# Altium schematic sheet op-pcb-mcp23017-sch.SchDoc
size 149 x 149 mm; SheetNumber: 1; SheetTotal: 1
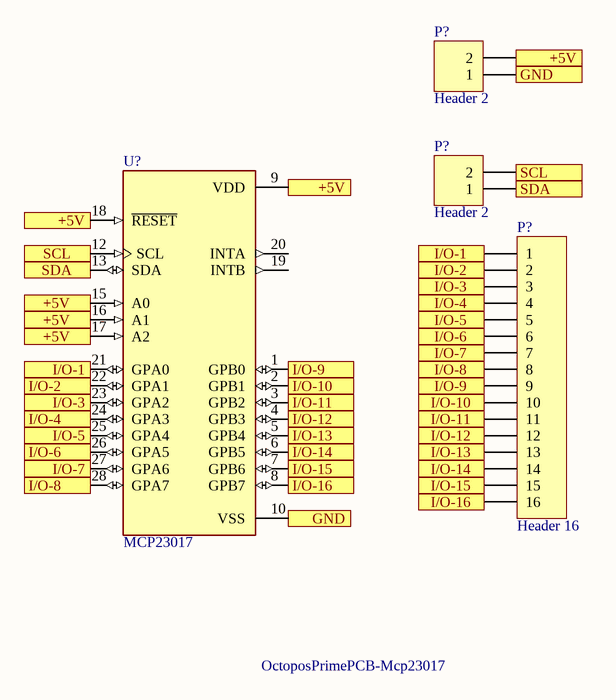
[diagram p0: op-pcb-mcp23017-sch.SchDoc]

## Parts
(Parts that share a designator on the sheet are numbered #1, #2 ... from top to bottom, then left to right.)
P?#1  Header 2  [HDR1X2]
P?#2  Header 2  [HDR1X2]
P?#3  Header 16  [HDR1X16]
U?  MCP23017  [MCP23017]

## Ports
+5V (in), GND (in), I/O-1 (in), I/O-2 (in), I/O-3 (in), I/O-4 (in), I/O-5 (in), I/O-6 (in), I/O-7 (in), I/O-8 (in), I/O-9 (in), I/O-10 (in), I/O-11 (in), I/O-12 (in), I/O-13 (in), I/O-14 (in), I/O-15 (in), I/O-16 (in), SCL (in), SDA (in)

## Nets
+5V: P?#1.2 U?.9(VDD) U?.15(A0) U?.16(A1) U?.17(A2) U?.18(~{RESET}) ; port +5V
GND: P?#1.1 U?.10(VSS) ; port GND
I/O-1: P?#3.1 U?.21(GPA0) ; port I/O-1
I/O-2: P?#3.2 U?.22(GPA1) ; port I/O-2
I/O-3: P?#3.3 U?.23(GPA2) ; port I/O-3
I/O-4: P?#3.4 U?.24(GPA3) ; port I/O-4
I/O-5: P?#3.5 U?.25(GPA4) ; port I/O-5
I/O-6: P?#3.6 U?.26(GPA5) ; port I/O-6
I/O-7: P?#3.7 U?.27(GPA6) ; port I/O-7
I/O-8: P?#3.8 U?.28(GPA7) ; port I/O-8
I/O-9: P?#3.9 U?.1(GPB0) ; port I/O-9
I/O-10: P?#3.10 U?.2(GPB1) ; port I/O-10
I/O-11: P?#3.11 U?.3(GPB2) ; port I/O-11
I/O-12: P?#3.12 U?.4(GPB3) ; port I/O-12
I/O-13: P?#3.13 U?.5(GPB4) ; port I/O-13
I/O-14: P?#3.14 U?.6(GPB5) ; port I/O-14
I/O-15: P?#3.15 U?.7(GPB6) ; port I/O-15
I/O-16: P?#3.16 U?.8(GPB7) ; port I/O-16
SCL: P?#2.2 U?.12(SCL) ; port SCL
SDA: P?#2.1 U?.13(SDA) ; port SDA

Not connected (* = marked no-connect by the designer): U? 19(INTB) 20(INTA)

## Notes on the sheet
- OctoposPrimePCB-Mcp23017

## Library data of the parts
P?#1 P?#2 = Header 2: Header, 2-Pin; LatestRevisionDate: 17-Jul-2002; LatestRevisionNote: Re-released for DXP Platform.; Publisher: Altium Limited
P?#3 = Header 16: Header, 16-Pin; LatestRevisionDate: 17-Jul-2002; LatestRevisionNote: Re-released for DXP Platform.; Publisher: Altium Limited